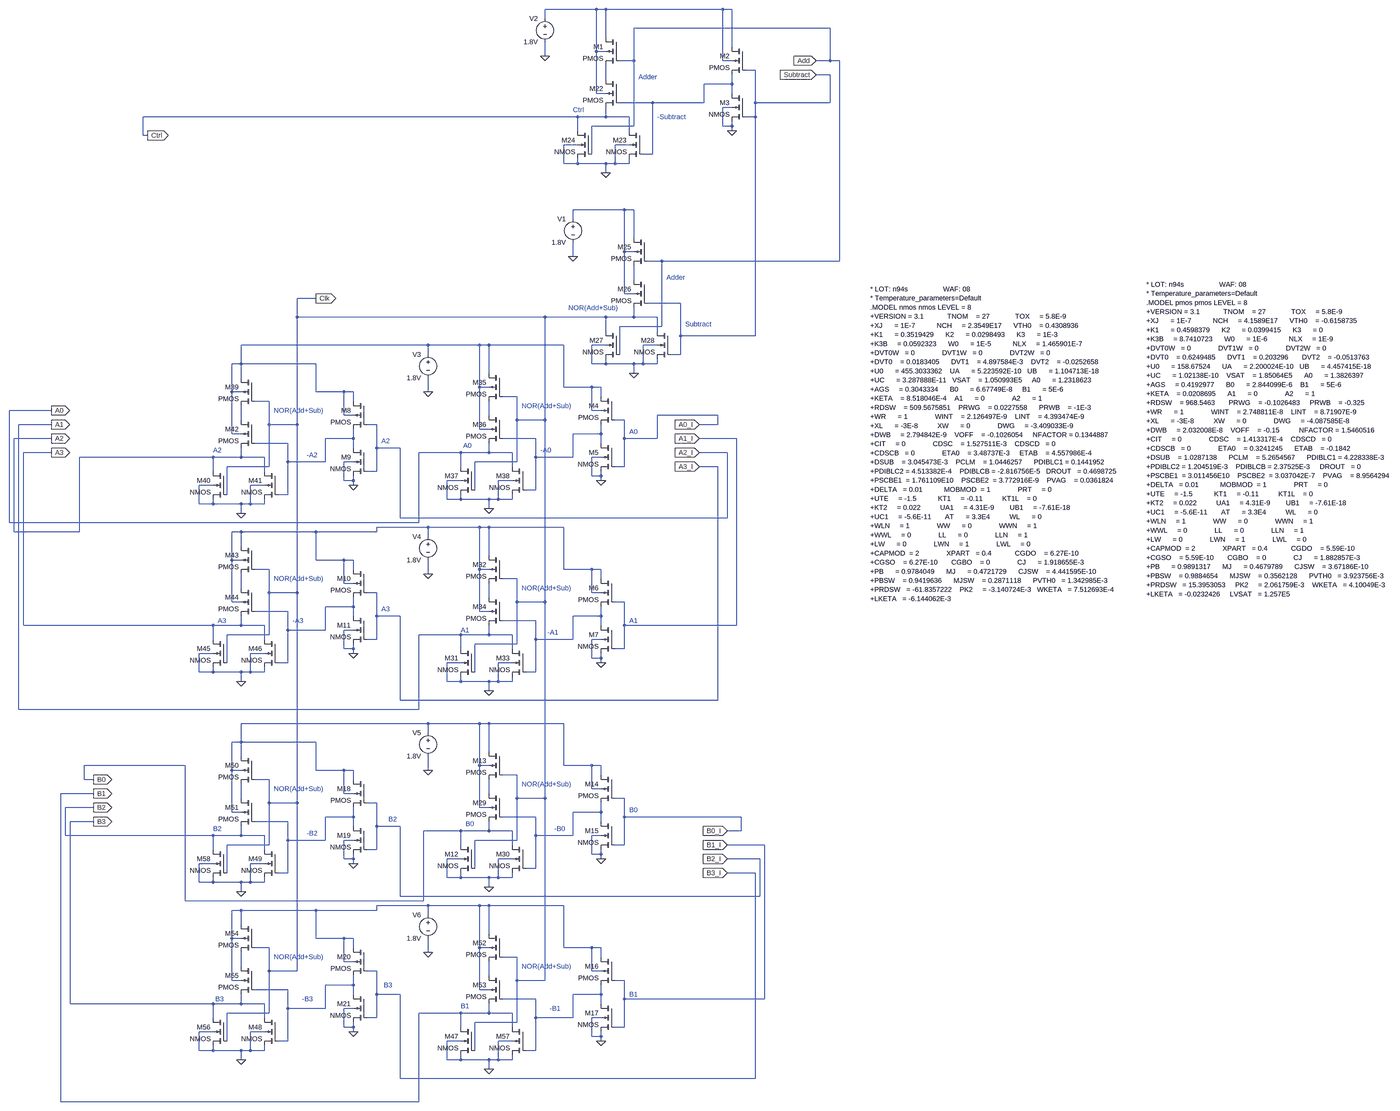
[diagram p0: schematic Logic_Circuit_Add-Sub.asc, whole sheet]
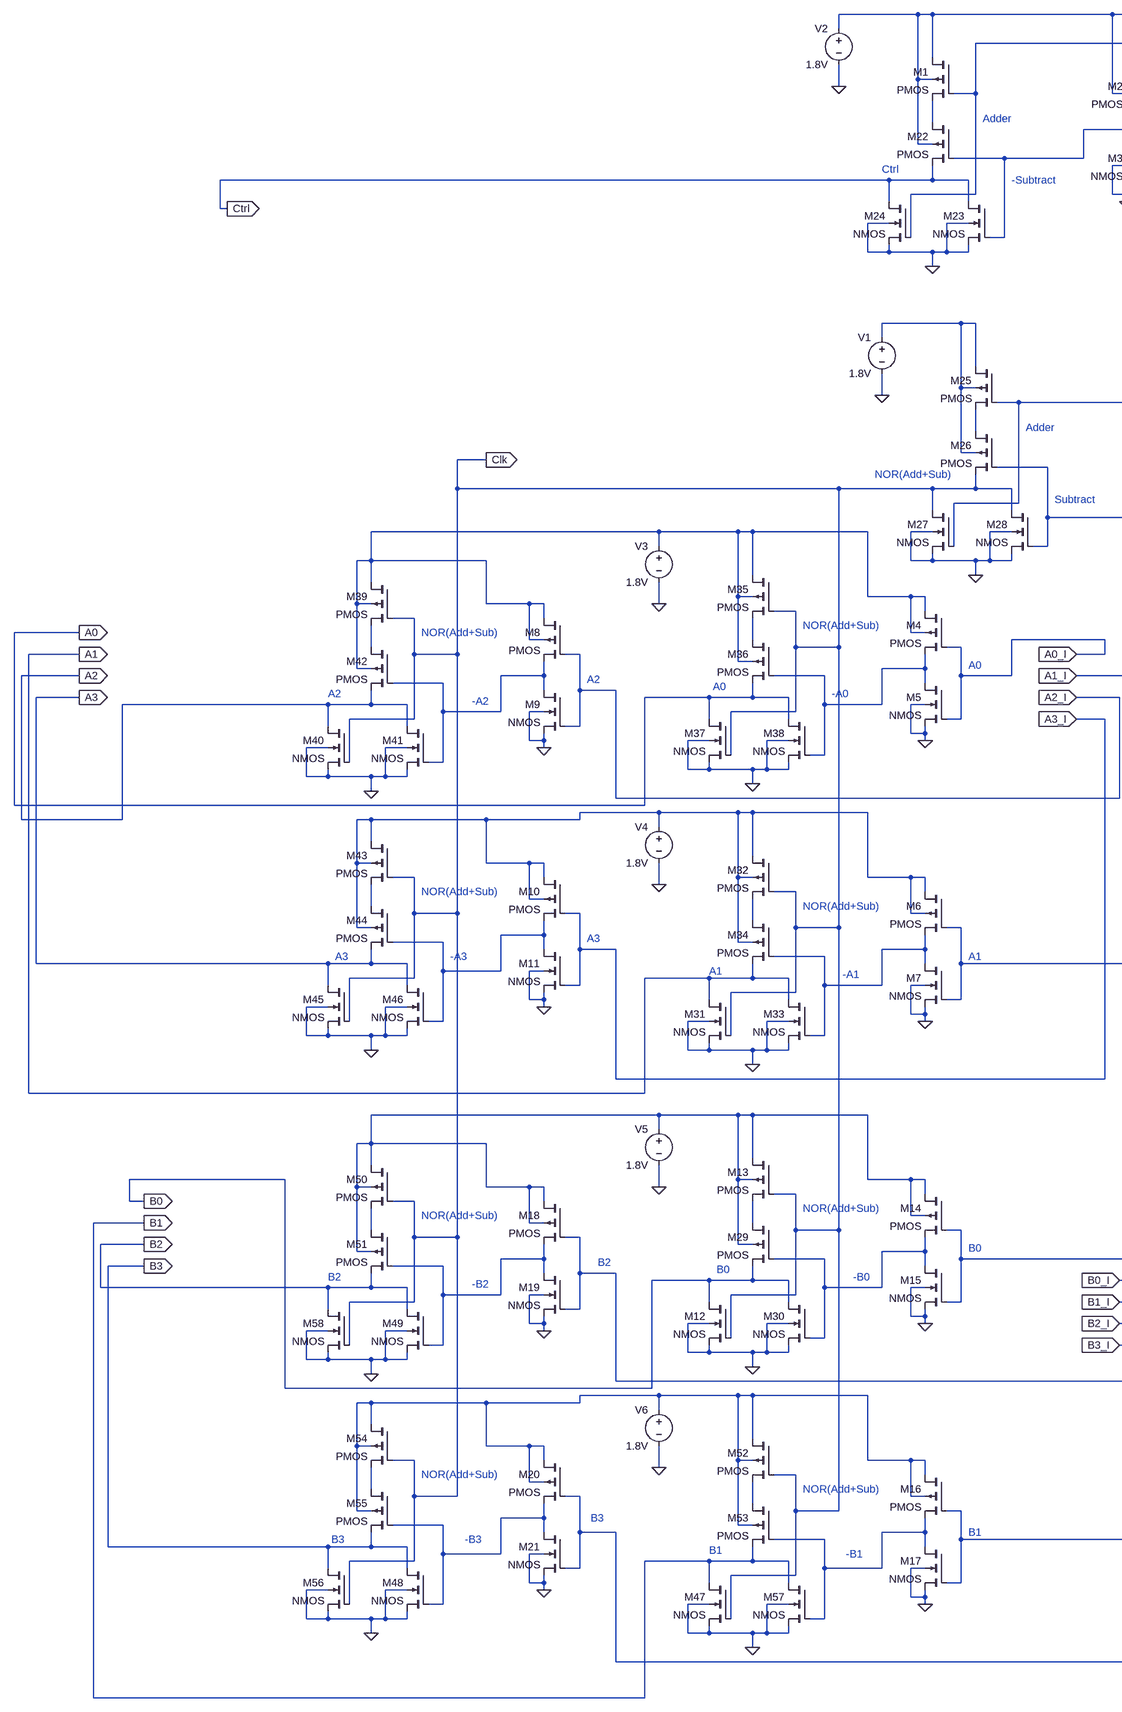
[diagram p1: schematic Logic_Circuit_Add-Sub.asc, part, row 1 of 1, column 1 of 2]
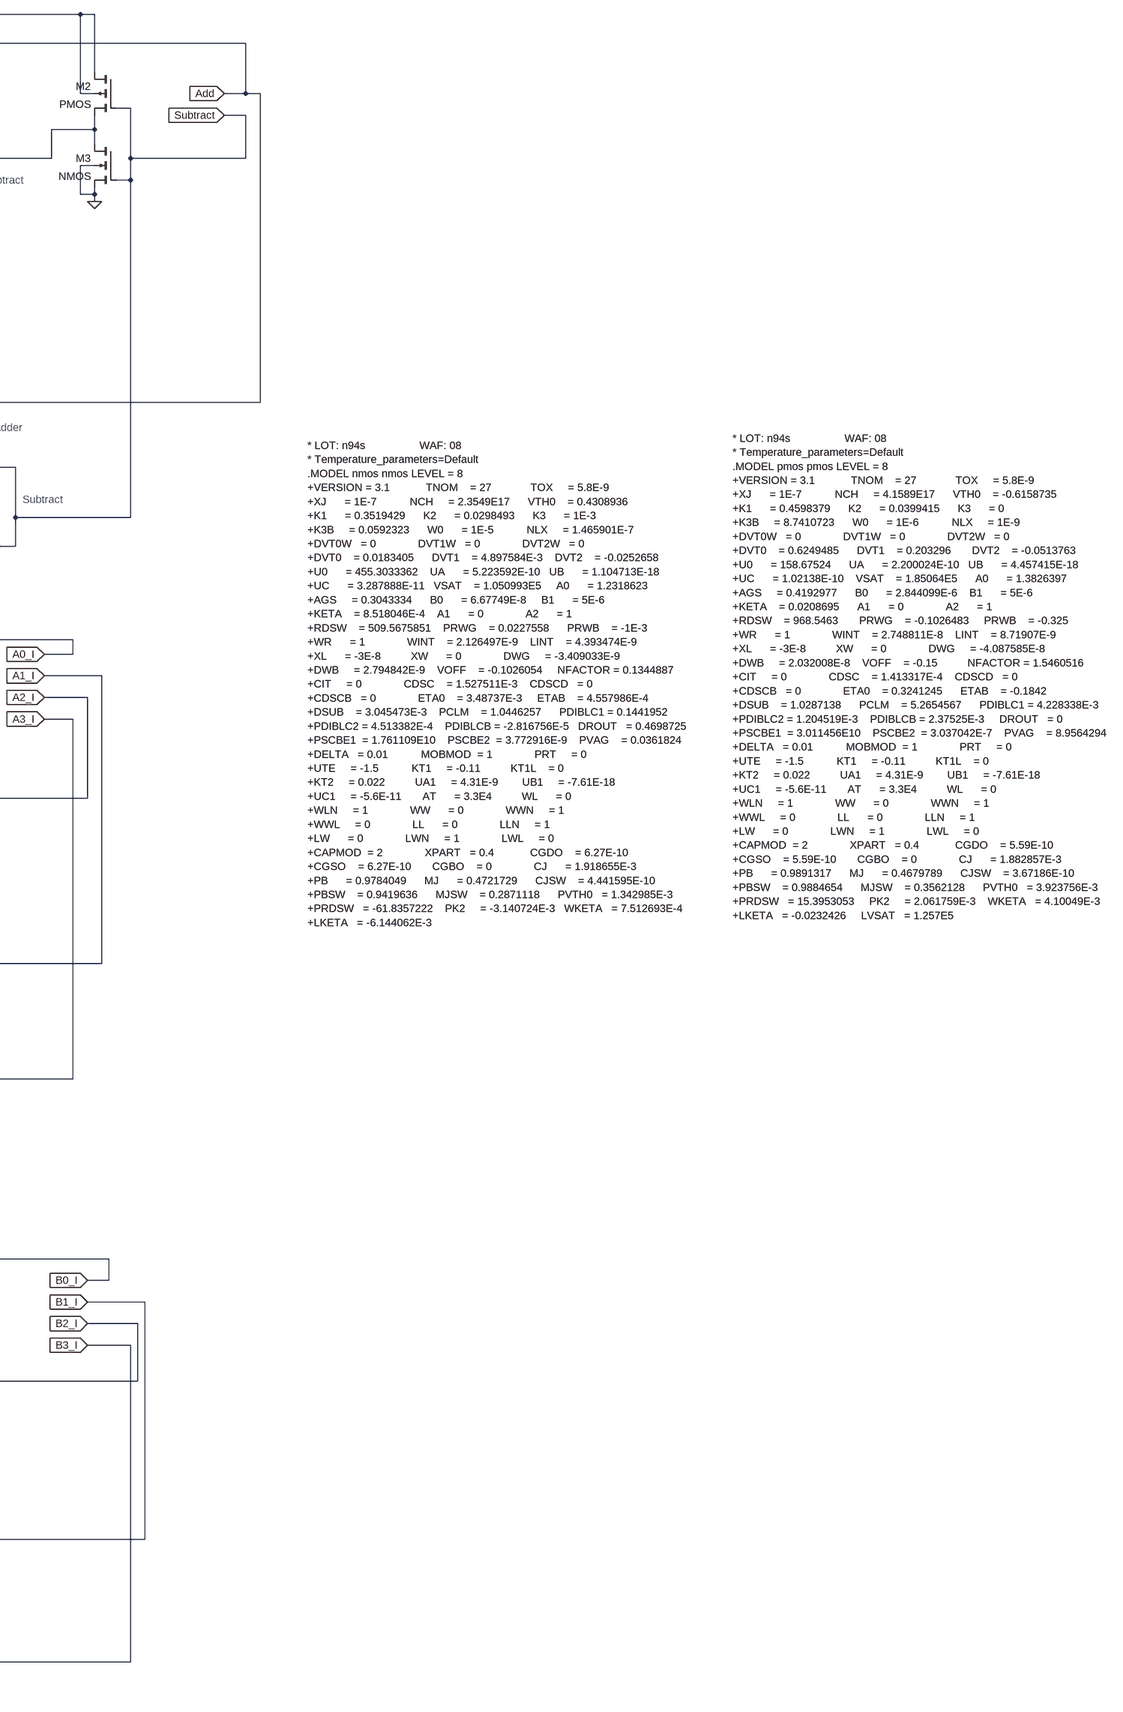
[diagram p2: schematic Logic_Circuit_Add-Sub.asc, part, row 1 of 1, column 2 of 2]
Logic_Circuit_Add-Sub.asc, the LTspice schematic file:
Version 4
SHEET 1 4552 1844
WIRE 1296 -1904 1120 -1904
WIRE 1328 -1904 1296 -1904
WIRE 1728 -1904 1328 -1904
WIRE 1760 -1904 1728 -1904
WIRE 1120 -1872 1120 -1904
WIRE 2096 -1840 1424 -1840
WIRE 1328 -1808 1328 -1904
WIRE 1760 -1776 1760 -1904
WIRE 1296 -1760 1296 -1904
WIRE 1328 -1760 1296 -1760
WIRE 1120 -1744 1120 -1792
WIRE 1424 -1728 1424 -1840
WIRE 1424 -1728 1376 -1728
WIRE 1728 -1728 1728 -1904
WIRE 1760 -1728 1728 -1728
WIRE 2096 -1728 2096 -1840
WIRE 2096 -1728 2048 -1728
WIRE 2128 -1728 2096 -1728
WIRE 1840 -1696 1808 -1696
WIRE 2096 -1680 2048 -1680
WIRE 1328 -1664 1328 -1712
WIRE 1760 -1648 1760 -1680
WIRE 1760 -1648 1664 -1648
WIRE 1296 -1616 1296 -1760
WIRE 1328 -1616 1296 -1616
WIRE 1760 -1616 1760 -1648
WIRE 1488 -1584 1376 -1584
WIRE 1664 -1584 1664 -1648
WIRE 1664 -1584 1488 -1584
WIRE 1840 -1584 1840 -1696
WIRE 2096 -1584 2096 -1680
WIRE 2096 -1584 1840 -1584
WIRE 1760 -1568 1728 -1568
WIRE 1232 -1536 -256 -1536
WIRE 1328 -1536 1328 -1568
WIRE 1328 -1536 1232 -1536
WIRE 1408 -1536 1328 -1536
WIRE 1840 -1536 1840 -1584
WIRE 1840 -1536 1808 -1536
WIRE 1424 -1504 1424 -1728
WIRE 1424 -1504 1280 -1504
WIRE 1728 -1504 1728 -1568
WIRE 1760 -1504 1760 -1520
WIRE 1760 -1504 1728 -1504
WIRE 1232 -1488 1232 -1536
WIRE 1408 -1488 1408 -1536
WIRE 1760 -1488 1760 -1504
WIRE -256 -1472 -256 -1536
WIRE -240 -1472 -256 -1472
WIRE 1232 -1440 1184 -1440
WIRE 1408 -1440 1360 -1440
WIRE 1280 -1408 1280 -1504
WIRE 1488 -1408 1488 -1584
WIRE 1488 -1408 1456 -1408
WIRE 1184 -1376 1184 -1440
WIRE 1232 -1376 1232 -1392
WIRE 1232 -1376 1184 -1376
WIRE 1328 -1376 1232 -1376
WIRE 1360 -1376 1360 -1440
WIRE 1360 -1376 1328 -1376
WIRE 1408 -1376 1408 -1392
WIRE 1408 -1376 1360 -1376
WIRE 1328 -1344 1328 -1376
WIRE 1392 -1216 1216 -1216
WIRE 1424 -1216 1392 -1216
WIRE 1216 -1184 1216 -1216
WIRE 1424 -1120 1424 -1216
WIRE 1392 -1072 1392 -1216
WIRE 1424 -1072 1392 -1072
WIRE 1216 -1056 1216 -1104
WIRE 1520 -1040 1472 -1040
WIRE 2128 -1040 2128 -1728
WIRE 2128 -1040 1520 -1040
WIRE 1424 -976 1424 -1024
WIRE 1392 -928 1392 -1072
WIRE 1424 -928 1392 -928
WIRE 336 -912 272 -912
WIRE 1584 -896 1472 -896
WIRE 272 -848 272 -912
WIRE 1120 -848 272 -848
WIRE 1328 -848 1120 -848
WIRE 1424 -848 1424 -880
WIRE 1424 -848 1328 -848
WIRE 1504 -848 1424 -848
WIRE 1520 -816 1520 -1040
WIRE 1520 -816 1376 -816
WIRE 1328 -800 1328 -848
WIRE 1504 -800 1504 -848
WIRE 1584 -784 1584 -896
WIRE 1840 -784 1840 -1536
WIRE 1840 -784 1584 -784
WIRE 720 -752 80 -752
WIRE 896 -752 720 -752
WIRE 928 -752 896 -752
WIRE 1184 -752 928 -752
WIRE 1328 -752 1280 -752
WIRE 1504 -752 1456 -752
WIRE 720 -720 720 -752
WIRE 1376 -720 1376 -816
WIRE 1584 -720 1584 -784
WIRE 1584 -720 1552 -720
WIRE 80 -688 80 -752
WIRE 80 -688 48 -688
WIRE 336 -688 80 -688
WIRE 1280 -688 1280 -752
WIRE 1328 -688 1328 -704
WIRE 1328 -688 1280 -688
WIRE 1424 -688 1328 -688
WIRE 1456 -688 1456 -752
WIRE 1456 -688 1424 -688
WIRE 1504 -688 1504 -704
WIRE 1504 -688 1456 -688
WIRE 928 -656 928 -752
WIRE 1424 -656 1424 -688
WIRE 80 -640 80 -688
WIRE 896 -608 896 -752
WIRE 928 -608 896 -608
WIRE 1184 -608 1184 -752
WIRE 1280 -608 1184 -608
WIRE 1312 -608 1280 -608
WIRE 48 -592 48 -688
WIRE 80 -592 48 -592
WIRE 336 -592 336 -688
WIRE 432 -592 336 -592
WIRE 464 -592 432 -592
WIRE 720 -592 720 -640
WIRE 1024 -576 976 -576
WIRE 1312 -576 1312 -608
WIRE 176 -560 128 -560
WIRE 464 -560 464 -592
WIRE -656 -528 -800 -528
WIRE 1280 -528 1280 -608
WIRE 1312 -528 1280 -528
WIRE 432 -512 432 -592
WIRE 464 -512 432 -512
WIRE 928 -512 928 -560
WIRE 1712 -512 1504 -512
WIRE 80 -496 80 -544
WIRE 1024 -496 1024 -576
WIRE 1120 -496 1120 -848
WIRE 1120 -496 1024 -496
WIRE 1392 -496 1360 -496
WIRE -656 -480 -768 -480
WIRE 176 -480 176 -560
WIRE 272 -480 272 -848
WIRE 272 -480 176 -480
WIRE 544 -480 512 -480
WIRE 1712 -480 1712 -512
WIRE 1712 -480 1648 -480
WIRE 896 -464 896 -608
WIRE 928 -464 896 -464
WIRE 48 -448 48 -592
WIRE 80 -448 48 -448
WIRE 1312 -448 1312 -480
WIRE 1312 -448 1216 -448
WIRE -656 -432 -784 -432
WIRE 464 -432 464 -464
WIRE 464 -432 368 -432
WIRE 1088 -432 976 -432
WIRE 1392 -432 1392 -496
WIRE 1504 -432 1504 -512
WIRE 1504 -432 1392 -432
WIRE 1776 -432 1648 -432
WIRE 240 -416 128 -416
WIRE 1312 -416 1312 -448
WIRE 464 -400 464 -432
WIRE 544 -400 544 -480
WIRE 624 -400 544 -400
WIRE -656 -384 -752 -384
WIRE 832 -384 688 -384
WIRE 928 -384 928 -416
WIRE 928 -384 832 -384
WIRE 1008 -384 928 -384
WIRE 1744 -384 1648 -384
WIRE -16 -368 -560 -368
WIRE 80 -368 80 -400
WIRE 80 -368 -16 -368
WIRE 160 -368 80 -368
WIRE 1088 -368 1088 -432
WIRE 1216 -368 1216 -448
WIRE 1216 -368 1088 -368
WIRE 1312 -368 1280 -368
WIRE 240 -352 240 -416
WIRE 368 -352 368 -432
WIRE 368 -352 240 -352
WIRE 464 -352 432 -352
WIRE 1024 -352 1024 -496
WIRE 1024 -352 880 -352
WIRE 176 -336 176 -480
WIRE 176 -336 32 -336
WIRE 832 -336 832 -384
WIRE 1008 -336 1008 -384
WIRE 1392 -336 1392 -432
WIRE 1392 -336 1360 -336
WIRE 1712 -336 1648 -336
WIRE -16 -320 -16 -368
WIRE 160 -320 160 -368
WIRE 544 -320 544 -400
WIRE 544 -320 512 -320
WIRE 1280 -304 1280 -368
WIRE 1312 -304 1312 -320
WIRE 1312 -304 1280 -304
WIRE 432 -288 432 -352
WIRE 464 -288 464 -304
WIRE 464 -288 432 -288
WIRE 832 -288 784 -288
WIRE 1008 -288 960 -288
WIRE 1312 -288 1312 -304
WIRE -16 -272 -64 -272
WIRE 160 -272 112 -272
WIRE 464 -272 464 -288
WIRE 880 -256 880 -352
WIRE 1088 -256 1088 -368
WIRE 1088 -256 1056 -256
WIRE 32 -240 32 -336
WIRE 240 -240 240 -352
WIRE 240 -240 208 -240
WIRE 784 -224 784 -288
WIRE 832 -224 832 -240
WIRE 832 -224 784 -224
WIRE 928 -224 832 -224
WIRE 960 -224 960 -288
WIRE 960 -224 928 -224
WIRE 1008 -224 1008 -240
WIRE 1008 -224 960 -224
WIRE -64 -208 -64 -272
WIRE -16 -208 -16 -224
WIRE -16 -208 -64 -208
WIRE 80 -208 -16 -208
WIRE 112 -208 112 -272
WIRE 112 -208 80 -208
WIRE 160 -208 160 -224
WIRE 160 -208 112 -208
WIRE 928 -192 928 -224
WIRE 80 -176 80 -208
WIRE 624 -160 624 -400
WIRE 1744 -160 1744 -384
WIRE 1744 -160 624 -160
WIRE -800 -144 -800 -528
WIRE 688 -144 688 -384
WIRE 688 -144 -800 -144
WIRE 720 -128 544 -128
WIRE 896 -128 720 -128
WIRE 928 -128 896 -128
WIRE 1184 -128 928 -128
WIRE -784 -112 -784 -432
WIRE -560 -112 -560 -368
WIRE -560 -112 -784 -112
WIRE 80 -112 48 -112
WIRE 336 -112 80 -112
WIRE 544 -112 544 -128
WIRE 544 -112 336 -112
WIRE 720 -96 720 -128
WIRE 80 -64 80 -112
WIRE 928 -32 928 -128
WIRE 48 -16 48 -112
WIRE 80 -16 48 -16
WIRE 336 -16 336 -112
WIRE 432 -16 336 -16
WIRE 464 -16 432 -16
WIRE 176 16 128 16
WIRE 464 16 464 -16
WIRE 896 16 896 -128
WIRE 928 16 896 16
WIRE 1184 16 1184 -128
WIRE 1280 16 1184 16
WIRE 1312 16 1280 16
WIRE 720 32 720 -16
WIRE 1024 48 976 48
WIRE 1312 48 1312 16
WIRE 432 64 432 -16
WIRE 464 64 432 64
WIRE 80 80 80 32
WIRE 176 96 176 16
WIRE 272 96 272 -480
WIRE 272 96 176 96
WIRE 544 96 512 96
WIRE 1280 96 1280 16
WIRE 1312 96 1280 96
WIRE 928 112 928 64
WIRE 48 128 48 -16
WIRE 80 128 48 128
WIRE 1024 128 1024 48
WIRE 1120 128 1120 -496
WIRE 1120 128 1024 128
WIRE 1392 128 1360 128
WIRE 464 144 464 112
WIRE 464 144 368 144
WIRE 240 160 128 160
WIRE 896 160 896 16
WIRE 928 160 896 160
WIRE 464 176 464 144
WIRE 544 176 544 96
WIRE 624 176 544 176
WIRE 1312 176 1312 144
WIRE 1312 176 1216 176
WIRE 1088 192 976 192
WIRE -752 208 -752 -384
WIRE -16 208 -752 208
WIRE 80 208 80 176
WIRE 80 208 -16 208
WIRE 160 208 80 208
WIRE 1312 208 1312 176
WIRE 1392 208 1392 128
WIRE 1776 208 1776 -432
WIRE 1776 208 1392 208
WIRE 240 224 240 160
WIRE 368 224 368 144
WIRE 368 224 240 224
WIRE 464 224 432 224
WIRE 176 240 176 96
WIRE 176 240 32 240
WIRE 832 240 688 240
WIRE 928 240 928 208
WIRE 928 240 832 240
WIRE 1008 240 928 240
WIRE -16 256 -16 208
WIRE 160 256 160 208
WIRE 544 256 544 176
WIRE 544 256 512 256
WIRE 1088 256 1088 192
WIRE 1216 256 1216 176
WIRE 1216 256 1088 256
WIRE 1312 256 1280 256
WIRE 1024 272 1024 128
WIRE 1024 272 880 272
WIRE 432 288 432 224
WIRE 464 288 464 272
WIRE 464 288 432 288
WIRE 832 288 832 240
WIRE 1008 288 1008 240
WIRE 1392 288 1392 208
WIRE 1392 288 1360 288
WIRE -16 304 -64 304
WIRE 160 304 112 304
WIRE 464 304 464 288
WIRE 1280 320 1280 256
WIRE 1312 320 1312 304
WIRE 1312 320 1280 320
WIRE 32 336 32 240
WIRE 240 336 240 224
WIRE 240 336 208 336
WIRE 832 336 784 336
WIRE 1008 336 960 336
WIRE 1312 336 1312 320
WIRE -64 368 -64 304
WIRE -16 368 -16 352
WIRE -16 368 -64 368
WIRE 80 368 -16 368
WIRE 112 368 112 304
WIRE 112 368 80 368
WIRE 160 368 160 352
WIRE 160 368 112 368
WIRE 880 368 880 272
WIRE 1088 368 1088 256
WIRE 1088 368 1056 368
WIRE 80 400 80 368
WIRE 784 400 784 336
WIRE 832 400 832 384
WIRE 832 400 784 400
WIRE 928 400 832 400
WIRE 960 400 960 336
WIRE 960 400 928 400
WIRE 1008 400 1008 384
WIRE 1008 400 960 400
WIRE 928 432 928 400
WIRE 624 464 624 176
WIRE 1712 464 1712 -336
WIRE 1712 464 624 464
WIRE -768 496 -768 -480
WIRE 688 496 688 240
WIRE 688 496 -768 496
WIRE 720 544 80 544
WIRE 896 544 720 544
WIRE 928 544 896 544
WIRE 1184 544 928 544
WIRE 720 576 720 544
WIRE 80 608 80 544
WIRE 80 608 48 608
WIRE 336 608 80 608
WIRE 928 640 928 544
WIRE 80 656 80 608
WIRE -112 688 -544 688
WIRE 896 688 896 544
WIRE 928 688 896 688
WIRE 1184 688 1184 544
WIRE 1280 688 1184 688
WIRE 1312 688 1280 688
WIRE 48 704 48 608
WIRE 80 704 48 704
WIRE 336 704 336 608
WIRE 432 704 336 704
WIRE 464 704 432 704
WIRE 720 704 720 656
WIRE 1024 720 976 720
WIRE 1312 720 1312 688
WIRE -544 736 -544 688
WIRE -512 736 -544 736
WIRE 176 736 128 736
WIRE 464 736 464 704
WIRE 1280 768 1280 688
WIRE 1312 768 1280 768
WIRE -512 784 -624 784
WIRE 432 784 432 704
WIRE 464 784 432 784
WIRE 928 784 928 736
WIRE 80 800 80 752
WIRE 1024 800 1024 720
WIRE 1120 800 1120 128
WIRE 1120 800 1024 800
WIRE 1392 800 1360 800
WIRE 176 816 176 736
WIRE 272 816 272 96
WIRE 272 816 176 816
WIRE 544 816 512 816
WIRE -512 832 -608 832
WIRE 896 832 896 688
WIRE 928 832 896 832
WIRE 48 848 48 704
WIRE 80 848 48 848
WIRE 1312 848 1312 816
WIRE 1312 848 1216 848
WIRE 464 864 464 832
WIRE 464 864 368 864
WIRE 1088 864 976 864
WIRE 1392 864 1392 800
WIRE 1792 864 1392 864
WIRE -512 880 -592 880
WIRE 240 880 128 880
WIRE 1312 880 1312 848
WIRE 464 896 464 864
WIRE 544 896 544 816
WIRE 624 896 544 896
WIRE 832 912 704 912
WIRE 928 912 928 880
WIRE 928 912 832 912
WIRE 1008 912 928 912
WIRE 1792 912 1792 864
WIRE 1792 912 1744 912
WIRE -608 928 -608 832
WIRE -16 928 -608 928
WIRE 80 928 80 896
WIRE 80 928 -16 928
WIRE 160 928 80 928
WIRE 1088 928 1088 864
WIRE 1216 928 1216 848
WIRE 1216 928 1088 928
WIRE 1312 928 1280 928
WIRE 240 944 240 880
WIRE 368 944 368 864
WIRE 368 944 240 944
WIRE 464 944 432 944
WIRE 1024 944 1024 800
WIRE 1024 944 880 944
WIRE 176 960 176 816
WIRE 176 960 32 960
WIRE 832 960 832 912
WIRE 1008 960 1008 912
WIRE 1392 960 1392 864
WIRE 1392 960 1360 960
WIRE 1872 960 1744 960
WIRE -16 976 -16 928
WIRE 160 976 160 928
WIRE 544 976 544 896
WIRE 544 976 512 976
WIRE 1280 992 1280 928
WIRE 1312 992 1312 976
WIRE 1312 992 1280 992
WIRE 432 1008 432 944
WIRE 464 1008 464 992
WIRE 464 1008 432 1008
WIRE 832 1008 784 1008
WIRE 1008 1008 960 1008
WIRE 1312 1008 1312 992
WIRE 1856 1008 1744 1008
WIRE -16 1024 -64 1024
WIRE 160 1024 112 1024
WIRE 464 1024 464 1008
WIRE 880 1040 880 944
WIRE 1088 1040 1088 928
WIRE 1088 1040 1056 1040
WIRE 32 1056 32 960
WIRE 240 1056 240 944
WIRE 240 1056 208 1056
WIRE 1840 1056 1744 1056
WIRE 784 1072 784 1008
WIRE 832 1072 832 1056
WIRE 832 1072 784 1072
WIRE 928 1072 832 1072
WIRE 960 1072 960 1008
WIRE 960 1072 928 1072
WIRE 1008 1072 1008 1056
WIRE 1008 1072 960 1072
WIRE -64 1088 -64 1024
WIRE -16 1088 -16 1072
WIRE -16 1088 -64 1088
WIRE 80 1088 -16 1088
WIRE 112 1088 112 1024
WIRE 112 1088 80 1088
WIRE 160 1088 160 1072
WIRE 160 1088 112 1088
WIRE 928 1104 928 1072
WIRE 80 1120 80 1088
WIRE 624 1136 624 896
WIRE 1856 1136 1856 1008
WIRE 1856 1136 624 1136
WIRE -112 1152 -112 688
WIRE 704 1152 704 912
WIRE 704 1152 -112 1152
WIRE 720 1168 544 1168
WIRE 896 1168 720 1168
WIRE 928 1168 896 1168
WIRE 1184 1168 928 1168
WIRE 80 1184 48 1184
WIRE 336 1184 80 1184
WIRE 544 1184 544 1168
WIRE 544 1184 336 1184
WIRE 720 1200 720 1168
WIRE 80 1232 80 1184
WIRE 928 1264 928 1168
WIRE 48 1280 48 1184
WIRE 80 1280 48 1280
WIRE 336 1280 336 1184
WIRE 432 1280 336 1280
WIRE 464 1280 432 1280
WIRE 176 1312 128 1312
WIRE 464 1312 464 1280
WIRE 896 1312 896 1168
WIRE 928 1312 896 1312
WIRE 1184 1312 1184 1168
WIRE 1280 1312 1184 1312
WIRE 1312 1312 1280 1312
WIRE 720 1328 720 1280
WIRE 1024 1344 976 1344
WIRE 1312 1344 1312 1312
WIRE 432 1360 432 1280
WIRE 464 1360 432 1360
WIRE 80 1376 80 1328
WIRE 176 1392 176 1312
WIRE 272 1392 272 816
WIRE 272 1392 176 1392
WIRE 544 1392 512 1392
WIRE 1280 1392 1280 1312
WIRE 1312 1392 1280 1392
WIRE 928 1408 928 1360
WIRE 48 1424 48 1280
WIRE 80 1424 48 1424
WIRE 1024 1424 1024 1344
WIRE 1120 1424 1120 800
WIRE 1120 1424 1024 1424
WIRE 1392 1424 1360 1424
WIRE 464 1440 464 1408
WIRE 464 1440 368 1440
WIRE 240 1456 128 1456
WIRE 896 1456 896 1312
WIRE 928 1456 896 1456
WIRE 464 1472 464 1440
WIRE 544 1472 544 1392
WIRE 624 1472 544 1472
WIRE 1312 1472 1312 1440
WIRE 1312 1472 1216 1472
WIRE 1088 1488 976 1488
WIRE 1392 1488 1392 1424
WIRE 1872 1488 1872 960
WIRE 1872 1488 1392 1488
WIRE -592 1504 -592 880
WIRE -16 1504 -592 1504
WIRE 80 1504 80 1472
WIRE 80 1504 -16 1504
WIRE 160 1504 80 1504
WIRE 1312 1504 1312 1472
WIRE 240 1520 240 1456
WIRE 368 1520 368 1440
WIRE 368 1520 240 1520
WIRE 464 1520 432 1520
WIRE 176 1536 176 1392
WIRE 176 1536 32 1536
WIRE 832 1536 688 1536
WIRE 928 1536 928 1504
WIRE 928 1536 832 1536
WIRE 1008 1536 928 1536
WIRE -16 1552 -16 1504
WIRE 160 1552 160 1504
WIRE 544 1552 544 1472
WIRE 544 1552 512 1552
WIRE 1088 1552 1088 1488
WIRE 1216 1552 1216 1472
WIRE 1216 1552 1088 1552
WIRE 1312 1552 1280 1552
WIRE 1024 1568 1024 1424
WIRE 1024 1568 880 1568
WIRE 432 1584 432 1520
WIRE 464 1584 464 1568
WIRE 464 1584 432 1584
WIRE 832 1584 832 1536
WIRE 1008 1584 1008 1536
WIRE 1392 1584 1392 1488
WIRE 1392 1584 1360 1584
WIRE -16 1600 -64 1600
WIRE 160 1600 112 1600
WIRE 464 1600 464 1584
WIRE 1280 1616 1280 1552
WIRE 1312 1616 1312 1600
WIRE 1312 1616 1280 1616
WIRE 32 1632 32 1536
WIRE 240 1632 240 1520
WIRE 240 1632 208 1632
WIRE 832 1632 784 1632
WIRE 1008 1632 960 1632
WIRE 1312 1632 1312 1616
WIRE -64 1664 -64 1600
WIRE -16 1664 -16 1648
WIRE -16 1664 -64 1664
WIRE 80 1664 -16 1664
WIRE 112 1664 112 1600
WIRE 112 1664 80 1664
WIRE 160 1664 160 1648
WIRE 160 1664 112 1664
WIRE 880 1664 880 1568
WIRE 1088 1664 1088 1552
WIRE 1088 1664 1056 1664
WIRE 80 1696 80 1664
WIRE 784 1696 784 1632
WIRE 832 1696 832 1680
WIRE 832 1696 784 1696
WIRE 928 1696 832 1696
WIRE 960 1696 960 1632
WIRE 960 1696 928 1696
WIRE 1008 1696 1008 1680
WIRE 1008 1696 960 1696
WIRE 928 1728 928 1696
WIRE 624 1760 624 1472
WIRE 1840 1760 1840 1056
WIRE 1840 1760 624 1760
WIRE -624 1840 -624 784
WIRE 688 1840 688 1536
WIRE 688 1840 -624 1840
FLAG 1216 -1056 0
FLAG 1424 -656 0
FLAG 1120 -1744 0
FLAG 1328 -1344 0
FLAG 1760 -1488 0
FLAG 720 -592 0
FLAG 928 -192 0
FLAG 1312 -288 0
FLAG 720 32 0
FLAG 928 432 0
FLAG 1312 336 0
FLAG 80 -176 0
FLAG 464 -272 0
FLAG 80 400 0
FLAG 464 304 0
FLAG 2048 -1728 Add
IOPIN 2048 -1728 In
FLAG 2048 -1680 Subtract
IOPIN 2048 -1680 In
FLAG 720 704 0
FLAG 928 1104 0
FLAG 1312 1008 0
FLAG 720 1328 0
FLAG 928 1728 0
FLAG 1312 1632 0
FLAG 80 1120 0
FLAG 464 1024 0
FLAG 80 1696 0
FLAG 464 1600 0
FLAG 1648 -480 A0_I
IOPIN 1648 -480 In
FLAG 1648 -432 A1_I
IOPIN 1648 -432 In
FLAG 1648 -384 A2_I
IOPIN 1648 -384 In
FLAG 1648 -336 A3_I
IOPIN 1648 -336 In
FLAG -656 -528 A0
IOPIN -656 -528 Out
FLAG -656 -480 A1
IOPIN -656 -480 Out
FLAG -656 -432 A2
IOPIN -656 -432 Out
FLAG -656 -384 A3
IOPIN -656 -384 Out
FLAG -240 -1472 Ctrl
IOPIN -240 -1472 Out
FLAG 1744 912 B0_I
IOPIN 1744 912 In
FLAG 1744 960 B1_I
IOPIN 1744 960 In
FLAG 1744 1008 B2_I
IOPIN 1744 1008 In
FLAG 1744 1056 B3_I
IOPIN 1744 1056 In
FLAG -512 736 B0
IOPIN -512 736 Out
FLAG -512 784 B1
IOPIN -512 784 Out
FLAG -512 832 B2
IOPIN -512 832 Out
FLAG -512 880 B3
IOPIN -512 880 Out
FLAG 336 -912 Clk
IOPIN 336 -912 Out
SYMBOL voltage 1216 -1200 M0
WINDOW 123 0 0 Left 0
WINDOW 39 0 0 Left 0
SYMATTR InstName V1
SYMATTR Value 1.8V
SYMBOL pmos4 1376 -1808 M0
SYMATTR InstName M1
SYMATTR Value2 l=180n w=6000n
SYMBOL voltage 1120 -1888 M0
WINDOW 123 0 0 Left 0
WINDOW 39 0 0 Left 0
SYMATTR InstName V2
SYMATTR Value 1.8V
SYMBOL pmos4 1808 -1776 M0
SYMATTR InstName M2
SYMATTR Value2 l=180n w=3000n
SYMBOL nmos4 1808 -1616 M0
SYMATTR InstName M3
SYMATTR Value2 l=180n w=1500n
SYMBOL voltage 720 -736 M0
WINDOW 123 0 0 Left 0
WINDOW 39 0 0 Left 0
SYMATTR InstName V3
SYMATTR Value 1.8V
SYMBOL pmos4 1360 -576 M0
SYMATTR InstName M4
SYMATTR Value2 l=180n w=880n
SYMBOL nmos4 1360 -416 M0
SYMATTR InstName M5
SYMATTR Value2 l=180n w=440n
SYMBOL voltage 720 -112 M0
WINDOW 123 0 0 Left 0
WINDOW 39 0 0 Left 0
SYMATTR InstName V4
SYMATTR Value 1.8V
SYMBOL pmos4 1360 48 M0
SYMATTR InstName M6
SYMATTR Value2 l=180n w=880n
SYMBOL nmos4 1360 208 M0
SYMATTR InstName M7
SYMATTR Value2 l=180n w=440n
SYMBOL pmos4 512 -560 M0
SYMATTR InstName M8
SYMATTR Value2 l=180n w=880n
SYMBOL nmos4 512 -400 M0
SYMATTR InstName M9
SYMATTR Value2 l=180n w=440n
SYMBOL pmos4 512 16 M0
SYMATTR InstName M10
SYMATTR Value2 l=180n w=880n
SYMBOL nmos4 512 176 M0
SYMATTR InstName M11
SYMATTR Value2 l=180n w=440n
SYMBOL pmos4 1376 -1664 M0
SYMATTR InstName M22
SYMATTR Value2 l=180n w=6000n
SYMBOL nmos4 1456 -1488 M0
SYMATTR InstName M23
SYMATTR Value2 l=180n w=1500n
SYMBOL nmos4 1280 -1488 M0
SYMATTR InstName M24
SYMATTR Value2 l=180n w=1500n
SYMBOL pmos4 1472 -1120 M0
SYMATTR InstName M25
SYMATTR Value2 l=180n w=6000n
SYMBOL pmos4 1472 -976 M0
SYMATTR InstName M26
SYMATTR Value2 l=180n w=6000n
SYMBOL nmos4 1376 -800 M0
SYMATTR InstName M27
SYMATTR Value2 l=180n w=2500n
SYMBOL nmos4 1552 -800 M0
SYMATTR InstName M28
SYMATTR Value2 l=180n w=2500n
SYMBOL nmos4 880 288 M0
SYMATTR InstName M31
SYMATTR Value2 l=180n w=750n
SYMBOL pmos4 976 -32 M0
SYMATTR InstName M32
SYMATTR Value2 l=180n w=3000n
SYMBOL nmos4 1056 288 M0
SYMATTR InstName M33
SYMATTR Value2 l=180n w=750n
SYMBOL pmos4 976 112 M0
SYMATTR InstName M34
SYMATTR Value2 l=180n w=3000n
SYMBOL pmos4 976 -656 M0
SYMATTR InstName M35
SYMATTR Value2 l=180n w=3000n
SYMBOL pmos4 976 -512 M0
SYMATTR InstName M36
SYMATTR Value2 l=180n w=3000n
SYMBOL nmos4 880 -336 M0
SYMATTR InstName M37
SYMATTR Value2 l=180n w=750n
SYMBOL nmos4 1056 -336 M0
SYMATTR InstName M38
SYMATTR Value2 l=180n w=750n
SYMBOL pmos4 128 -640 M0
SYMATTR InstName M39
SYMATTR Value2 l=180n w=3000n
SYMBOL nmos4 32 -320 M0
SYMATTR InstName M40
SYMATTR Value2 l=180n w=750n
SYMBOL nmos4 208 -320 M0
SYMATTR InstName M41
SYMATTR Value2 l=180n w=750n
SYMBOL pmos4 128 -496 M0
SYMATTR InstName M42
SYMATTR Value2 l=180n w=3000n
SYMBOL pmos4 128 -64 M0
SYMATTR InstName M43
SYMATTR Value2 l=180n w=3000n
SYMBOL pmos4 128 80 M0
SYMATTR InstName M44
SYMATTR Value2 l=180n w=3000n
SYMBOL nmos4 32 256 M0
SYMATTR InstName M45
SYMATTR Value2 l=180n w=750n
SYMBOL nmos4 208 256 M0
SYMATTR InstName M46
SYMATTR Value2 l=180n w=750n
SYMBOL nmos4 880 960 M0
SYMATTR InstName M12
SYMATTR Value2 l=180n w=750n
SYMBOL pmos4 976 640 M0
SYMATTR InstName M13
SYMATTR Value2 l=180n w=3000n
SYMBOL voltage 720 560 M0
WINDOW 123 0 0 Left 0
WINDOW 39 0 0 Left 0
SYMATTR InstName V5
SYMATTR Value 1.8V
SYMBOL pmos4 1360 720 M0
SYMATTR InstName M14
SYMATTR Value2 l=180n w=880n
SYMBOL nmos4 1360 880 M0
SYMATTR InstName M15
SYMATTR Value2 l=180n w=440n
SYMBOL voltage 720 1184 M0
WINDOW 123 0 0 Left 0
WINDOW 39 0 0 Left 0
SYMATTR InstName V6
SYMATTR Value 1.8V
SYMBOL pmos4 1360 1344 M0
SYMATTR InstName M16
SYMATTR Value2 l=180n w=880n
SYMBOL nmos4 1360 1504 M0
SYMATTR InstName M17
SYMATTR Value2 l=180n w=440n
SYMBOL pmos4 512 736 M0
SYMATTR InstName M18
SYMATTR Value2 l=180n w=880n
SYMBOL nmos4 512 896 M0
SYMATTR InstName M19
SYMATTR Value2 l=180n w=440n
SYMBOL pmos4 512 1312 M0
SYMATTR InstName M20
SYMATTR Value2 l=180n w=880n
SYMBOL nmos4 512 1472 M0
SYMATTR InstName M21
SYMATTR Value2 l=180n w=440n
SYMBOL pmos4 976 784 M0
SYMATTR InstName M29
SYMATTR Value2 l=180n w=3000n
SYMBOL nmos4 1056 960 M0
SYMATTR InstName M30
SYMATTR Value2 l=180n w=750n
SYMBOL nmos4 880 1584 M0
SYMATTR InstName M47
SYMATTR Value2 l=180n w=750n
SYMBOL nmos4 208 1552 M0
SYMATTR InstName M48
SYMATTR Value2 l=180n w=750n
SYMBOL nmos4 208 976 M0
SYMATTR InstName M49
SYMATTR Value2 l=180n w=750n
SYMBOL pmos4 128 656 M0
SYMATTR InstName M50
SYMATTR Value2 l=180n w=3000n
SYMBOL pmos4 128 800 M0
SYMATTR InstName M51
SYMATTR Value2 l=180n w=3000n
SYMBOL pmos4 976 1264 M0
SYMATTR InstName M52
SYMATTR Value2 l=180n w=3000n
SYMBOL pmos4 976 1408 M0
SYMATTR InstName M53
SYMATTR Value2 l=180n w=3000n
SYMBOL pmos4 128 1232 M0
SYMATTR InstName M54
SYMATTR Value2 l=180n w=3000n
SYMBOL pmos4 128 1376 M0
SYMATTR InstName M55
SYMATTR Value2 l=180n w=3000n
SYMBOL nmos4 32 1552 M0
SYMATTR InstName M56
SYMATTR Value2 l=180n w=750n
SYMBOL nmos4 1056 1584 M0
SYMATTR InstName M57
SYMATTR Value2 l=180n w=750n
SYMBOL nmos4 32 976 M0
SYMATTR InstName M58
SYMATTR Value2 l=180n w=750n
TEXT 1536 -984 Left 2 ;Adder
TEXT 1600 -824 Left 2 ;Subtract
TEXT 1440 -1672 Left 2 ;Adder
TEXT 1504 -1536 Left 2 ;-Subtract
TEXT 1216 -1560 Left 2 ;Ctrl
TEXT 1200 -880 Left 2 ;NOR(Add+Sub)
TEXT 1040 -544 Left 2 ;NOR(Add+Sub)
TEXT 1104 -392 Left 2 ;-A0
TEXT 1040 80 Left 2 ;NOR(Add+Sub)
TEXT 840 -408 Left 2 ;A0
TEXT 1128 232 Left 2 ;-A1
TEXT 832 224 Left 2 ;A1
TEXT 1408 192 Left 2 ;A1
TEXT 1408 -456 Left 2 ;A0
TEXT 192 -528 Left 2 ;NOR(Add+Sub)
TEXT 560 -424 Left 2 ;A2
TEXT 304 -376 Left 2 ;-A2
TEXT -16 -392 Left 2 ;A2
TEXT 192 48 Left 2 ;NOR(Add+Sub)
TEXT 560 152 Left 2 ;A3
TEXT 256 192 Left 2 ;-A3
TEXT 0 192 Left 2 ;A3
TEXT 2712 -944 Left 2 !* LOT: n94s                  WAF: 08\n* Temperature_parameters=Default\n.MODEL nmos nmos LEVEL = 8\n+VERSION = 3.1            TNOM    = 27             TOX     = 5.8E-9\n+XJ      = 1E-7           NCH     = 2.3549E17      VTH0    = 0.4308936\n+K1      = 0.3519429      K2      = 0.0298493      K3      = 1E-3\n+K3B     = 0.0592323      W0      = 1E-5           NLX     = 1.465901E-7\n+DVT0W   = 0              DVT1W   = 0              DVT2W   = 0\n+DVT0    = 0.0183405      DVT1    = 4.897584E-3    DVT2    = -0.0252658\n+U0      = 455.3033362    UA      = 5.223592E-10   UB      = 1.104713E-18\n+UC      = 3.287888E-11   VSAT    = 1.050993E5     A0      = 1.2318623\n+AGS     = 0.3043334      B0      = 6.67749E-8     B1      = 5E-6\n+KETA    = 8.518046E-4    A1      = 0              A2      = 1\n+RDSW    = 509.5675851    PRWG    = 0.0227558      PRWB    = -1E-3\n+WR      = 1              WINT    = 2.126497E-9    LINT    = 4.393474E-9\n+XL      = -3E-8          XW      = 0              DWG     = -3.409033E-9\n+DWB     = 2.794842E-9    VOFF    = -0.1026054     NFACTOR = 0.1344887\n+CIT     = 0              CDSC    = 1.527511E-3    CDSCD   = 0\n+CDSCB   = 0              ETA0    = 3.48737E-3     ETAB    = 4.557986E-4\n+DSUB    = 3.045473E-3    PCLM    = 1.0446257      PDIBLC1 = 0.1441952\n+PDIBLC2 = 4.513382E-4    PDIBLCB = -2.816756E-5   DROUT   = 0.4698725\n+PSCBE1  = 1.761109E10    PSCBE2  = 3.772916E-9    PVAG    = 0.0361824\n+DELTA   = 0.01           MOBMOD  = 1              PRT     = 0\n+UTE     = -1.5           KT1     = -0.11          KT1L    = 0\n+KT2     = 0.022          UA1     = 4.31E-9        UB1     = -7.61E-18\n+UC1     = -5.6E-11       AT      = 3.3E4          WL      = 0\n+WLN     = 1              WW      = 0              WWN     = 1\n+WWL     = 0              LL      = 0              LLN     = 1\n+LW      = 0              LWN     = 1              LWL     = 0\n+CAPMOD  = 2              XPART   = 0.4            CGDO    = 6.27E-10\n+CGSO    = 6.27E-10       CGBO    = 0              CJ      = 1.918655E-3\n+PB      = 0.9784049      MJ      = 0.4721729      CJSW    = 4.441595E-10\n+PBSW    = 0.9419636      MJSW    = 0.2871118      PVTH0   = 1.342985E-3\n+PRDSW   = -61.8357222    PK2     = -3.140724E-3   WKETA   = 7.512693E-4\n+LKETA   = -6.144062E-3
TEXT 3672 -960 Left 2 !* LOT: n94s                  WAF: 08\n* Temperature_parameters=Default\n.MODEL pmos pmos LEVEL = 8\n+VERSION = 3.1            TNOM    = 27             TOX     = 5.8E-9\n+XJ      = 1E-7           NCH     = 4.1589E17      VTH0    = -0.6158735\n+K1      = 0.4598379      K2      = 0.0399415      K3      = 0\n+K3B     = 8.7410723      W0      = 1E-6           NLX     = 1E-9\n+DVT0W   = 0              DVT1W   = 0              DVT2W   = 0\n+DVT0    = 0.6249485      DVT1    = 0.203296       DVT2    = -0.0513763\n+U0      = 158.67524      UA      = 2.200024E-10   UB      = 4.457415E-18\n+UC      = 1.02138E-10    VSAT    = 1.85064E5      A0      = 1.3826397\n+AGS     = 0.4192977      B0      = 2.844099E-6    B1      = 5E-6\n+KETA    = 0.0208695      A1      = 0              A2      = 1\n+RDSW    = 968.5463       PRWG    = -0.1026483     PRWB    = -0.325\n+WR      = 1              WINT    = 2.748811E-8    LINT    = 8.71907E-9\n+XL      = -3E-8          XW      = 0              DWG     = -4.087585E-8\n+DWB     = 2.032008E-8    VOFF    = -0.15          NFACTOR = 1.5460516\n+CIT     = 0              CDSC    = 1.413317E-4    CDSCD   = 0\n+CDSCB   = 0              ETA0    = 0.3241245      ETAB    = -0.1842\n+DSUB    = 1.0287138      PCLM    = 5.2654567      PDIBLC1 = 4.228338E-3\n+PDIBLC2 = 1.204519E-3    PDIBLCB = 2.37525E-3     DROUT   = 0\n+PSCBE1  = 3.011456E10    PSCBE2  = 3.037042E-7    PVAG    = 8.9564294\n+DELTA   = 0.01           MOBMOD  = 1              PRT     = 0\n+UTE     = -1.5           KT1     = -0.11          KT1L    = 0\n+KT2     = 0.022          UA1     = 4.31E-9        UB1     = -7.61E-18\n+UC1     = -5.6E-11       AT      = 3.3E4          WL      = 0\n+WLN     = 1              WW      = 0              WWN     = 1\n+WWL     = 0              LL      = 0              LLN     = 1\n+LW      = 0              LWN     = 1              LWL     = 0\n+CAPMOD  = 2              XPART   = 0.4            CGDO    = 5.59E-10\n+CGSO    = 5.59E-10       CGBO    = 0              CJ      = 1.882857E-3\n+PB      = 0.9891317      MJ      = 0.4679789      CJSW    = 3.67186E-10\n+PBSW    = 0.9884654      MJSW    = 0.3562128      PVTH0   = 3.923756E-3\n+PRDSW   = 15.3953053     PK2     = 2.061759E-3    WKETA   = 4.10049E-3\n+LKETA   = -0.0232426     LVSAT   = 1.257E5
TEXT 1040 752 Left 2 ;NOR(Add+Sub)
TEXT 1040 1376 Left 2 ;NOR(Add+Sub)
TEXT 192 768 Left 2 ;NOR(Add+Sub)
TEXT 192 1344 Left 2 ;NOR(Add+Sub)
TEXT 1408 840 Left 2 ;B0
TEXT 1408 1472 Left 2 ;B1
TEXT 568 1440 Left 2 ;B3
TEXT 584 872 Left 2 ;B2
TEXT 1152 904 Left 2 ;-B0
TEXT 1136 1520 Left 2 ;-B1
TEXT 304 920 Left 2 ;-B2
TEXT 288 1488 Left 2 ;-B3
TEXT 848 888 Left 2 ;B0
TEXT 832 1512 Left 2 ;B1
TEXT -16 904 Left 2 ;B2
TEXT -8 1488 Left 2 ;B3

The netlist it stands for:
* Logic_Circuit_Add-Sub.asc
V1 N004 0 1.8V
M1 N001 Add N002 N001 PMOS l=180n w=6000n
V2 N001 0 1.8V
M2 N001 Subtract N003 N001 PMOS l=180n w=3000n
M3 N003 Subtract 0 0 NMOS l=180n w=1500n
V3 N006 0 1.8V
M4 N006 A0_I N009 N006 PMOS l=180n w=880n
M5 N009 A0_I 0 0 NMOS l=180n w=440n
V4 N011 0 1.8V
M6 N011 A1_I N015 N011 PMOS l=180n w=880n
M7 N015 A1_I 0 0 NMOS l=180n w=440n
M8 N006 A2_I N010 N006 PMOS l=180n w=880n
M9 N010 A2_I 0 0 NMOS l=180n w=440n
M10 N011 A3_I N014 N011 PMOS l=180n w=880n
M11 N014 A3_I 0 0 NMOS l=180n w=440n
M22 N002 N003 Ctrl N001 PMOS l=180n w=6000n
M23 Ctrl N003 0 0 NMOS l=180n w=1500n
M24 Ctrl Add 0 0 NMOS l=180n w=1500n
M25 N004 Add N005 N004 PMOS l=180n w=6000n
M26 N005 Subtract Clk N004 PMOS l=180n w=6000n
M27 Clk Add 0 0 NMOS l=180n w=2500n
M28 Clk Subtract 0 0 NMOS l=180n w=2500n
M31 A1 Clk 0 0 NMOS l=180n w=750n
M32 N011 Clk N013 N011 PMOS l=180n w=3000n
M33 A1 N015 0 0 NMOS l=180n w=750n
M34 N013 N015 A1 N011 PMOS l=180n w=3000n
M35 N006 Clk N007 N006 PMOS l=180n w=3000n
M36 N007 N009 A0 N006 PMOS l=180n w=3000n
M37 A0 Clk 0 0 NMOS l=180n w=750n
M38 A0 N009 0 0 NMOS l=180n w=750n
M39 N006 Clk N008 N006 PMOS l=180n w=3000n
M40 A2 Clk 0 0 NMOS l=180n w=750n
M41 A2 N010 0 0 NMOS l=180n w=750n
M42 N008 N010 A2 N006 PMOS l=180n w=3000n
M43 N011 Clk N012 N011 PMOS l=180n w=3000n
M44 N012 N014 A3 N011 PMOS l=180n w=3000n
M45 A3 Clk 0 0 NMOS l=180n w=750n
M46 A3 N014 0 0 NMOS l=180n w=750n
M12 B0 Clk 0 0 NMOS l=180n w=750n
M13 N016 Clk N017 N016 PMOS l=180n w=3000n
V5 N016 0 1.8V
M14 N016 B0_I N019 N016 PMOS l=180n w=880n
M15 N019 B0_I 0 0 NMOS l=180n w=440n
V6 N021 0 1.8V
M16 N021 B1_I N025 N021 PMOS l=180n w=880n
M17 N025 B1_I 0 0 NMOS l=180n w=440n
M18 N016 B2_I N020 N016 PMOS l=180n w=880n
M19 N020 B2_I 0 0 NMOS l=180n w=440n
M20 N021 B3_I N024 N021 PMOS l=180n w=880n
M21 N024 B3_I 0 0 NMOS l=180n w=440n
M29 N017 N019 B0 N016 PMOS l=180n w=3000n
M30 B0 N019 0 0 NMOS l=180n w=750n
M47 B1 Clk 0 0 NMOS l=180n w=750n
M48 B3 N024 0 0 NMOS l=180n w=750n
M49 B2 N020 0 0 NMOS l=180n w=750n
M50 N016 Clk N018 N016 PMOS l=180n w=3000n
M51 N018 N020 B2 N016 PMOS l=180n w=3000n
M52 N021 Clk N023 N021 PMOS l=180n w=3000n
M53 N023 N025 B1 N021 PMOS l=180n w=3000n
M54 N021 Clk N022 N021 PMOS l=180n w=3000n
M55 N022 N024 B3 N021 PMOS l=180n w=3000n
M56 B3 Clk 0 0 NMOS l=180n w=750n
M57 B1 N025 0 0 NMOS l=180n w=750n
M58 B2 Clk 0 0 NMOS l=180n w=750n
.model NMOS NMOS
.model PMOS PMOS
.lib standard.mos
* Adder
* Subtract
* Adder
* -Subtract
* Ctrl
* NOR(Add+Sub)
* NOR(Add+Sub)
* -A0
* NOR(Add+Sub)
* A0
* -A1
* A1
* A1
* A0
* NOR(Add+Sub)
* A2
* -A2
* A2
* NOR(Add+Sub)
* A3
* -A3
* A3
* LOT: n94s                  WAF: 08
* Temperature_parameters=Default
.MODEL nmos nmos LEVEL = 8
+VERSION = 3.1            TNOM    = 27             TOX     = 5.8E-9
+XJ      = 1E-7           NCH     = 2.3549E17      VTH0    = 0.4308936
+K1      = 0.3519429      K2      = 0.0298493      K3      = 1E-3
+K3B     = 0.0592323      W0      = 1E-5           NLX     = 1.465901E-7
+DVT0W   = 0              DVT1W   = 0              DVT2W   = 0
+DVT0    = 0.0183405      DVT1    = 4.897584E-3    DVT2    = -0.0252658
+U0      = 455.3033362    UA      = 5.223592E-10   UB      = 1.104713E-18
+UC      = 3.287888E-11   VSAT    = 1.050993E5     A0      = 1.2318623
+AGS     = 0.3043334      B0      = 6.67749E-8     B1      = 5E-6
+KETA    = 8.518046E-4    A1      = 0              A2      = 1
+RDSW    = 509.5675851    PRWG    = 0.0227558      PRWB    = -1E-3
+WR      = 1              WINT    = 2.126497E-9    LINT    = 4.393474E-9
+XL      = -3E-8          XW      = 0              DWG     = -3.409033E-9
+DWB     = 2.794842E-9    VOFF    = -0.1026054     NFACTOR = 0.1344887
+CIT     = 0              CDSC    = 1.527511E-3    CDSCD   = 0
+CDSCB   = 0              ETA0    = 3.48737E-3     ETAB    = 4.557986E-4
+DSUB    = 3.045473E-3    PCLM    = 1.0446257      PDIBLC1 = 0.1441952
+PDIBLC2 = 4.513382E-4    PDIBLCB = -2.816756E-5   DROUT   = 0.4698725
+PSCBE1  = 1.761109E10    PSCBE2  = 3.772916E-9    PVAG    = 0.0361824
+DELTA   = 0.01           MOBMOD  = 1              PRT     = 0
+UTE     = -1.5           KT1     = -0.11          KT1L    = 0
+KT2     = 0.022          UA1     = 4.31E-9        UB1     = -7.61E-18
+UC1     = -5.6E-11       AT      = 3.3E4          WL      = 0
+WLN     = 1              WW      = 0              WWN     = 1
+WWL     = 0              LL      = 0              LLN     = 1
+LW      = 0              LWN     = 1              LWL     = 0
+CAPMOD  = 2              XPART   = 0.4            CGDO    = 6.27E-10
+CGSO    = 6.27E-10       CGBO    = 0              CJ      = 1.918655E-3
+PB      = 0.9784049      MJ      = 0.4721729      CJSW    = 4.441595E-10
+PBSW    = 0.9419636      MJSW    = 0.2871118      PVTH0   = 1.342985E-3
+PRDSW   = -61.8357222    PK2     = -3.140724E-3   WKETA   = 7.512693E-4
+LKETA   = -6.144062E-3
* LOT: n94s                  WAF: 08
* Temperature_parameters=Default
.MODEL pmos pmos LEVEL = 8
+VERSION = 3.1            TNOM    = 27             TOX     = 5.8E-9
+XJ      = 1E-7           NCH     = 4.1589E17      VTH0    = -0.6158735
+K1      = 0.4598379      K2      = 0.0399415      K3      = 0
+K3B     = 8.7410723      W0      = 1E-6           NLX     = 1E-9
+DVT0W   = 0              DVT1W   = 0              DVT2W   = 0
+DVT0    = 0.6249485      DVT1    = 0.203296       DVT2    = -0.0513763
+U0      = 158.67524      UA      = 2.200024E-10   UB      = 4.457415E-18
+UC      = 1.02138E-10    VSAT    = 1.85064E5      A0      = 1.3826397
+AGS     = 0.4192977      B0      = 2.844099E-6    B1      = 5E-6
+KETA    = 0.0208695      A1      = 0              A2      = 1
+RDSW    = 968.5463       PRWG    = -0.1026483     PRWB    = -0.325
+WR      = 1              WINT    = 2.748811E-8    LINT    = 8.71907E-9
+XL      = -3E-8          XW      = 0              DWG     = -4.087585E-8
+DWB     = 2.032008E-8    VOFF    = -0.15          NFACTOR = 1.5460516
+CIT     = 0              CDSC    = 1.413317E-4    CDSCD   = 0
+CDSCB   = 0              ETA0    = 0.3241245      ETAB    = -0.1842
+DSUB    = 1.0287138      PCLM    = 5.2654567      PDIBLC1 = 4.228338E-3
+PDIBLC2 = 1.204519E-3    PDIBLCB = 2.37525E-3     DROUT   = 0
+PSCBE1  = 3.011456E10    PSCBE2  = 3.037042E-7    PVAG    = 8.9564294
+DELTA   = 0.01           MOBMOD  = 1              PRT     = 0
+UTE     = -1.5           KT1     = -0.11          KT1L    = 0
+KT2     = 0.022          UA1     = 4.31E-9        UB1     = -7.61E-18
+UC1     = -5.6E-11       AT      = 3.3E4          WL      = 0
+WLN     = 1              WW      = 0              WWN     = 1
+WWL     = 0              LL      = 0              LLN     = 1
+LW      = 0              LWN     = 1              LWL     = 0
+CAPMOD  = 2              XPART   = 0.4            CGDO    = 5.59E-10
+CGSO    = 5.59E-10       CGBO    = 0              CJ      = 1.882857E-3
+PB      = 0.9891317      MJ      = 0.4679789      CJSW    = 3.67186E-10
+PBSW    = 0.9884654      MJSW    = 0.3562128      PVTH0   = 3.923756E-3
+PRDSW   = 15.3953053     PK2     = 2.061759E-3    WKETA   = 4.10049E-3
+LKETA   = -0.0232426     LVSAT   = 1.257E5
* NOR(Add+Sub)
* NOR(Add+Sub)
* NOR(Add+Sub)
* NOR(Add+Sub)
* B0
* B1
* B3
* B2
* -B0
* -B1
* -B2
* -B3
* B0
* B1
* B2
* B3
.backanno
.end